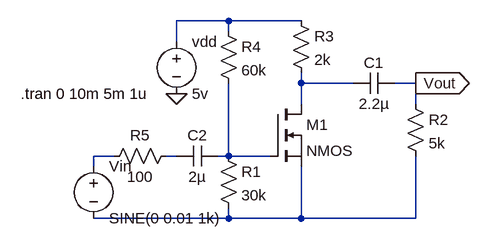
[diagram p0: schematic cs_amplifier_transient analysis.asc]
cs_amplifier_transient analysis.asc, the LTspice schematic file:
Version 4
SHEET 1 880 680
WIRE 160 16 80 16
WIRE 272 16 160 16
WIRE 160 32 160 16
WIRE 80 48 80 16
WIRE 272 112 272 96
WIRE 352 112 272 112
WIRE 448 112 416 112
WIRE 272 144 272 112
WIRE 448 144 448 112
WIRE -16 224 -48 224
WIRE 80 224 64 224
WIRE 160 224 160 112
WIRE 160 224 144 224
WIRE 224 224 160 224
WIRE -48 240 -48 224
WIRE 160 320 160 304
WIRE 160 320 -48 320
WIRE 272 320 272 240
WIRE 272 320 160 320
WIRE 448 320 448 224
WIRE 448 320 272 320
FLAG 80 128 0
FLAG 448 112 Vout
IOPIN 448 112 Out
SYMBOL nmos 224 144 R0
SYMATTR InstName M1
SYMBOL res 144 208 R0
SYMATTR InstName R1
SYMATTR Value 30k
SYMBOL cap 416 96 R90
WINDOW 0 0 32 VBottom 2
WINDOW 3 32 32 VTop 2
SYMATTR InstName C1
SYMATTR Value 2.2µ
SYMBOL res 432 128 R0
SYMATTR InstName R2
SYMATTR Value 5k
SYMBOL res 256 0 R0
SYMATTR InstName R3
SYMATTR Value 2k
SYMBOL res 144 16 R0
SYMATTR InstName R4
SYMATTR Value 60k
SYMBOL voltage 80 32 R0
SYMATTR InstName vdd
SYMATTR Value 5v
SYMBOL cap 144 208 R90
WINDOW 0 0 32 VBottom 2
WINDOW 3 32 32 VTop 2
SYMATTR InstName C2
SYMATTR Value 2µ
SYMBOL res 80 208 R90
WINDOW 0 0 56 VBottom 2
WINDOW 3 32 56 VTop 2
SYMATTR InstName R5
SYMATTR Value 100
SYMBOL voltage -48 224 R0
WINDOW 123 0 0 Left 0
WINDOW 39 0 0 Left 0
SYMATTR InstName Vin
SYMATTR Value SINE(0 0.01 1k)
TEXT -160 128 Left 2 !.tran 0 10m 5m 1u

The netlist it stands for:
* cs_amplifier_transient analysis.asc
M1 N002 N005 N006 N006 NMOS
R1 N005 N006 30k
C1 Vout N002 2.2µ
R2 Vout N006 5k
R3 N001 N002 2k
R4 N001 N005 60k
vdd N001 0 5v
C2 N005 N004 2µ
R5 N004 N003 100
Vin N003 N006 SINE(0 0.01 1k)
.model NMOS NMOS
.model PMOS PMOS
.lib standard.mos
.tran 0 10m 5m 1u
.backanno
.end